# Altium schematic sheet default.SchDoc
size 420 x 297 mm; DocumentNumber: 1; SheetNumber: 1; SheetTotal: 1; PageSetup: Record=PageOptions|CenterHorizontal=False|CenterVertical=False|PrintScale=0.70|XCorrection=0.00|YCorrection=0.00|PrintKind=0|BorderSize=5000000|LeftOffset=0|BottomOffset=0|Orientation=2|PaperLength=1000|PaperWidth=1000|Scale=100|PaperSource=15|PrintQuality=-3|MediaType=1|DitherType=10|PrintScaleMode=1|PaperKind=A4|PaperIndex=9; Scale: 1:1; DocumentType: Схема электрическая принципиальная
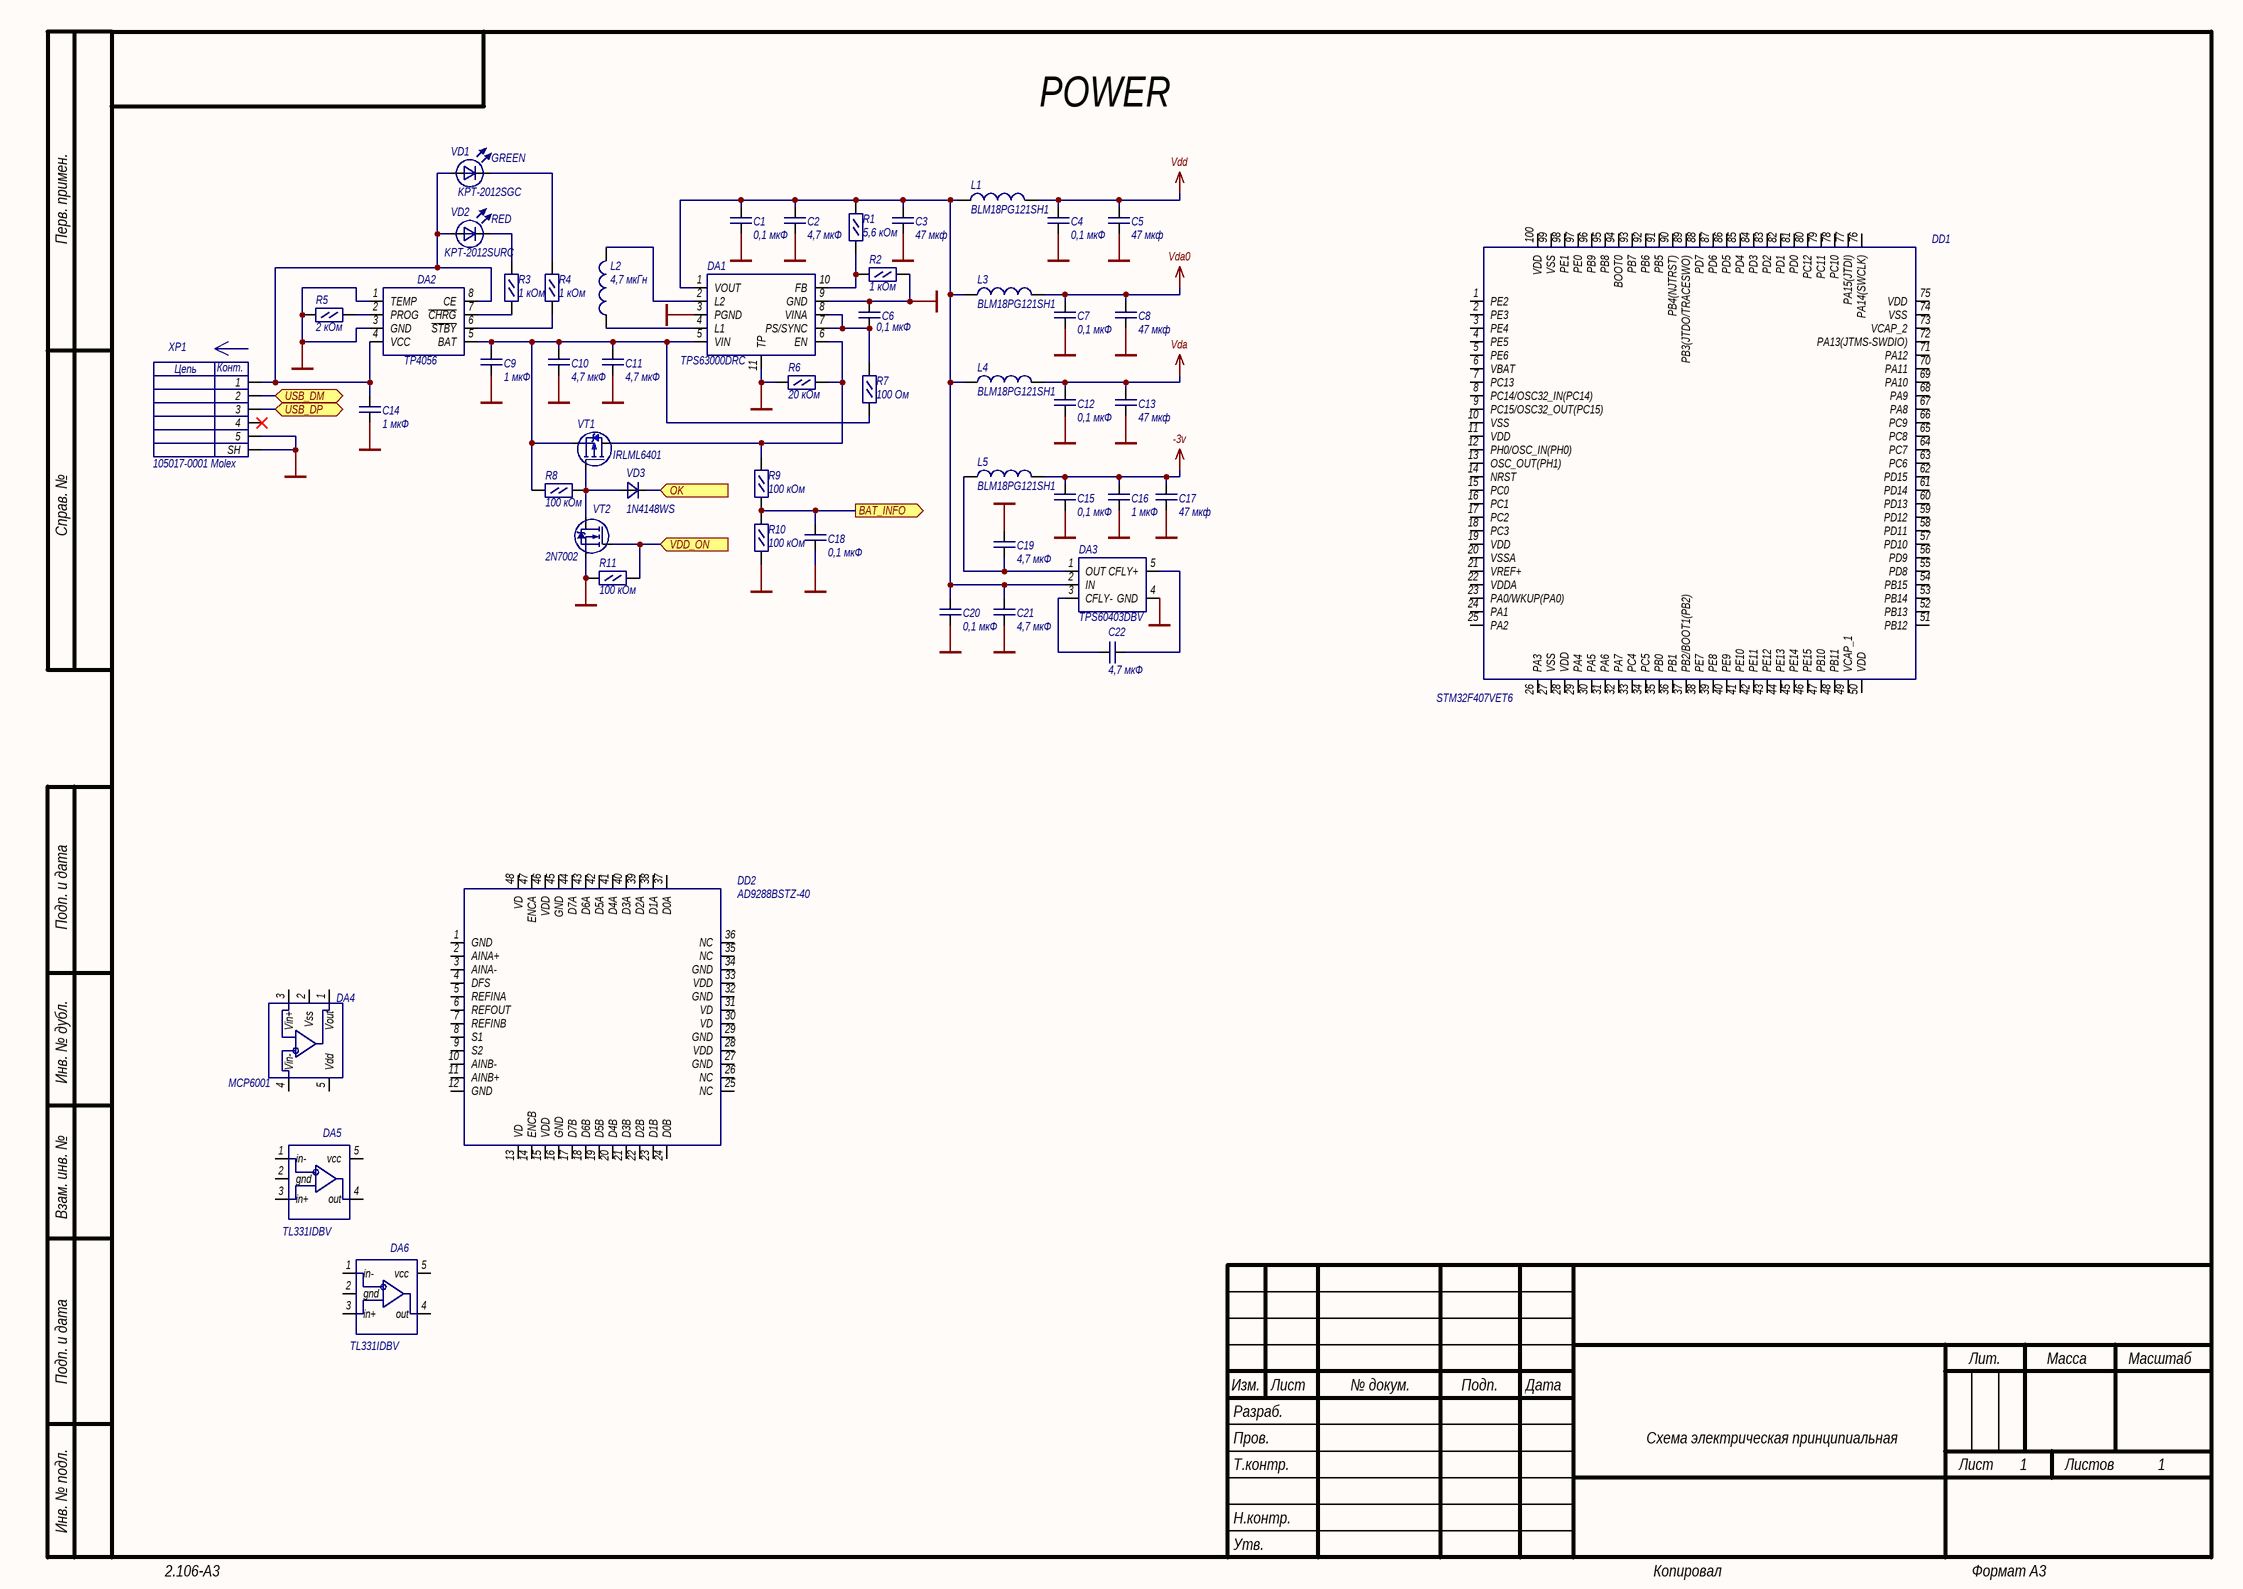
[diagram p0: default.SchDoc]

## Parts
C1  value 0,1 мкФ  [CAP0603]  (hidden comment: 0,1 мкФ 50 В)
C2  value 4,7 мкФ  [CAP0603]  (hidden comment: 4,7 мкФ 10 В)
C3  value 47 мкф  [CAP1206]  (hidden comment: 47 мкф 6,3 В)
C4  value 0,1 мкФ  [CAP0603]  (hidden comment: 0,1 мкФ 50 В)
C5  value 47 мкф  [CAP1206]  (hidden comment: 47 мкф 6,3 В)
C6  value 0,1 мкФ  [CAP0603]  (hidden comment: 0,1 мкФ 50 В)
C7  value 0,1 мкФ  [CAP0603]  (hidden comment: 0,1 мкФ 50 В)
C8  value 47 мкф  [CAP1206]  (hidden comment: 47 мкф 6,3 В)
C9  value 1 мкФ  [CAP0603]  (hidden comment: 1 мкФ 50 В)
C10  value 4,7 мкФ  [CAP0603]  (hidden comment: 4,7 мкФ 10 В)
C11  value 4,7 мкФ  [CAP0603]  (hidden comment: 4,7 мкФ 10 В)
C12  value 0,1 мкФ  [CAP0603]  (hidden comment: 0,1 мкФ 50 В)
C13  value 47 мкф  [CAP1206]  (hidden comment: 47 мкф 6,3 В)
C14  value 1 мкФ  [CAP0603]  (hidden comment: 1 мкФ 50 В)
C15  value 0,1 мкФ  [CAP0603]  (hidden comment: 0,1 мкФ 50 В)
C16  value 1 мкФ  [CAP0603]  (hidden comment: 1 мкФ 50 В)
C17  value 47 мкф  [CAP1206]  (hidden comment: 47 мкф 6,3 В)
C18  value 0,1 мкФ  [CAP0603]  (hidden comment: 0,1 мкФ 50 В)
C19  value 4,7 мкФ  [CAP0603]  (hidden comment: 4,7 мкФ 10 В)
C20  value 0,1 мкФ  [CAP0603]  (hidden comment: 0,1 мкФ 50 В)
C21  value 4,7 мкФ  [CAP0603]  (hidden comment: 4,7 мкФ 10 В)
C22  value 4,7 мкФ  [CAP0603]  (hidden comment: 4,7 мкФ 10 В)
DA1  TPS63000DRC  [SON10]
DA2  TP4056  [SO8_PAD]
DA3  TPS60403DBV  [SOT23-5]
DA4  MCP6001  [SOT23-5]
DA5  TL331IDBV  [SOT23-5]
DA6  TL331IDBV  [SOT23-5]
DD1  STM32F407VET6  [QFP100P50_1600X1600X160L60X22N]
DD2  AD9288BSTZ-40  [TQFP48_L]
L1  BLM18PG121SH1  [L0603]
L2  4,7 мкГн  [SRP4020]
L3  BLM18PG121SH1  [L0603]
L4  BLM18PG121SH1  [L0603]
L5  BLM18PG121SH1  [L0603]
R1  value 5,6 кОм  [RES0603]  (hidden comment: 5,6 кОм ±5%)
R2  value 1 кОм  [RES0603]  (hidden comment: 1 кОм ±5%)
R3  value 1 кОм  [RES0603]  (hidden comment: 1 кОм ±5%)
R4  value 1 кОм  [RES0603]  (hidden comment: 1 кОм ±5%)
R5  value 2 кОм  [RES0603]  (hidden comment: 2 кОм ±5%)
R6  value 20 кОм  [RES0603]  (hidden comment: 20 кОм ±5%)
R7  value 100 Ом  [RES0603]  (hidden comment: 100 Ом ±5%)
R8  value 100 кОм  [RES0603]  (hidden comment: 100 кОм ±5%)
R9  value 100 кОм  [RES0603]  (hidden comment: 100 кОм ±5%)
R10  value 100 кОм  [RES0603]  (hidden comment: 100 кОм ±5%)
R11  value 100 кОм  [RES0603]  (hidden comment: 100 кОм ±5%)
VD1  GREEN  value KPT-2012SGC  [LED-0805 GREEN]
VD2  RED  value KPT-2012SURC  [LED-0805 RED]
VD3  1N4148WS  [SOD323]
VT1  IRLML6401  [SOT23]
VT2  2N7002  [SOT23]
XP1  105017-0001 Molex  [USB_MICRO]

## Ports
BAT_INFO (out), OK (in), USB_DM, USB_DP, VDD_ON (in)

## Nets
-3v: C15.1 C16.1 C17.1 L5.2
GND: C1.2 C2.2 C3.2 C4.2 C5.2 C6.1 C7.2 C8.2 C9.2 C10.2 C11.2 C12.2 C13.2 C14.2 C15.2 C16.2 C17.2 C18.2 C19.2 C20.2 C21.2 DA1.3(PGND) DA1.9(GND) DA1.11(TP) DA2.1(TEMP) DA2.3(GND) DA3.4(GND) R2.1 R5.1 R6.1 R10.1 R11.1 VT2.2(S) XP1.5 XP1.SH
Vda: C12.1 C13.1 L4.2
Vda0: C7.1 C8.1 L3.2
Vdd: C4.1 C5.1 L1.2
BAT_INFO: C18.1 R9.1 R10.2 ; port BAT_INFO
OK: VD3.C ; port OK
USB_DM: XP1.2 ; port USB_DM
USB_DP: XP1.3 ; port USB_DP
VDD_ON: R11.2 VT2.1(G) ; port VDD_ON
NetC1_1: C1.1 C2.1 C3.1 C20.1 C21.1 DA1.1(VOUT) DA3.2(IN) L1.1 L3.1 L4.1 R1.2
NetC6_2: C6.2 DA1.7(PS/SYNC) DA1.8(VINA) R7.2
NetC9_1: C9.1 C10.1 C11.1 DA1.5(VIN) DA2.5(BAT) R7.1 R8.1 VT1.3(S)
NetC14_1: C14.1 DA2.4(VCC) DA2.8(CE) VD1.A VD2.A XP1.1
NetC19_1: C19.1 DA3.1(OUT) L5.1
NetC22_1: C22.1 DA3.3(CFLY-)
NetC22_2: C22.2 DA3.5(CFLY+)
NetDA1_2: DA1.2(L2) L2.2
NetDA1_4: DA1.4(L1) L2.1
NetDA1_6: DA1.6(EN) R6.2 R9.2 VT1.2(D)
NetDA1_10: DA1.10(FB) R1.1 R2.2
NetDA2_2: DA2.2(PROG) R5.2
NetDA2_6: DA2.6(~{STBY}) R4.1
NetDA2_7: DA2.7(~{CHRG}) R3.1
NetR3_2: R3.2 VD2.C
NetR4_2: R4.2 VD1.C
NetR8_2: R8.2 VD3.A VT1.1(G) VT2.3(D)

Not connected (* = marked no-connect by the designer): DA4 1(Vout) 2(Vss) 3(Vin+) 4(Vin-) 5(Vdd); DA5 1(in-) 2(gnd) 3(in+) 4(out) 5(vcc); DA6 1(in-) 2(gnd) 3(in+) 4(out) 5(vcc); DD1 1(PE2) 2(PE3) 3(PE4) 4(PE5) 5(PE6) 6(VBAT) 7(PC13) 8(PC14/OSC32_IN(PC14)) 9(PC15/OSC32_OUT(PC15)) 10(VSS) 11(VDD) 12(PH0/OSC_IN(PH0)) 13(OSC_OUT(PH1)) 14(NRST) 15(PC0) 16(PC1) 17(PC2) 18(PC3) 19(VDD) 20(VSSA) 21(VREF+) 22(VDDA) 23(PA0/WKUP(PA0)) 24(PA1) 25(PA2) 26(PA3) 27(VSS) 28(VDD) 29(PA4) 30(PA5) 31(PA6) 32(PA7) 33(PC4) 34(PC5) 35(PB0) 36(PB1) 37(PB2/BOOT1(PB2)) 38(PE7) 39(PE8) 40(PE9) 41(PE10) 42(PE11) 43(PE12) 44(PE13) 45(PE14) 46(PE15) 47(PB10) 48(PB11) 49(VCAP_1) 50(VDD) 51(PB12) 52(PB13) 53(PB14) 54(PB15) 55(PD8) 56(PD9) 57(PD10) 58(PD11) 59(PD12) 60(PD13) 61(PD14) 62(PD15) 63(PC6) 64(PC7) 65(PC8) 66(PC9) 67(PA8) 68(PA9) 69(PA10) 70(PA11) 71(PA12) 72(PA13(JTMS-SWDIO)) 73(VCAP_2) 74(VSS) 75(VDD) 76(PA14(SWCLK)) 77(PA15(JTDI)) 78(PC10) 79(PC11) 80(PC12) 81(PD0) 82(PD1) 83(PD2) 84(PD3) 85(PD4) 86(PD5) 87(PD6) 88(PD7) 89(PB3(JTDO/TRACESWO)) 90(PB4(NJTRST)) 91(PB5) 92(PB6) 93(PB7) 94(BOOT0) 95(PB8) 96(PB9) 97(PE0) 98(PE1) 99(VSS) 100(VDD); DD2 1(GND) 2(AINA+) 3(AINA-) 4(DFS) 5(REFINA) 6(REFOUT) 7(REFINB) 8(S1) 9(S2) 10(AINB-) 11(AINB+) 12(GND) 13(VD) 14(ENCB) 15(VDD) 16(GND) 17(D7B) 18(D6B) 19(D5B) 20(D4B) 21(D3B) 22(D2B) 23(D1B) 24(D0B) 25(NC) 26(NC) 27(GND) 28(VDD) 29(GND) 30(VD) 31(VD) 32(GND) 33(VDD) 34(GND) 35(NC) 36(NC) 37(D0A) 38(D1A) 39(D2A) 40(D3A) 41(D4A) 42(D5A) 43(D6A) 44(D7A) 45(GND) 46(VDD) 47(ENCA) 48(VD); XP1 4*

## Notes on the sheet
- POWER
- Перв. примен.
- Справ. №
- Подп. и дата
- Инв. № дубл.
- Взам. инв. №
- Разраб.
- Изм.
- Лист
- № докум.
- Подп.
- Дата
- Лит.
- Масса
- Масштаб
- Пров.
- Т.контр.
- Листов
- Инв. № подл.
- Утв.
- Н.контр.
- 2.106-A3
- Копировал
- Формат А3
- (in symbol CON_5_MICROUSB_105017-0001 Molex) Цепь; Конт.

## Library data of the parts
C1 C4 C6 C7 C12 C15 C18 C20 = С0603-0,1 мкФ-50 В-X7R-±10%-Yageo: Конденсатор SMD 0603; Manufacturer: Yageo; Part Number: CC0603KRX7R9BB104; Tolerance: ±10%; Voltage: 50 В; Type: X7R; Identifier: С0603-0,1 мкФ-50 В-X7R-±10%-Yageo; Value BOM: 0,1 мкФ; Operating Temperature: -55°C to +105°C; HelpURL: D:\_DS\CAP_YAGEO UPY-GPHC_X7R_6.3V-to-50V_16.pdf
C2 C10 C11 C19 C21 C22 = С0603-4,7 мкФ-10 В-X5R-±10%-Yageo: Конденсатор SMD 0603; Manufacturer: Yageo; Part Number: CC0603KRX5R6BB475; Tolerance: ±10%; Voltage: 10 В; Type: X5R; Identifier: С0603-4,7 мкФ-10 В-X5R-±10%-Yageo; Value BOM: 4,7 мкФ; Operating Temperature: -55°C to +85°C; HelpURL: D:\_DS\CAP_YAGEO UPY-GPHC_X5R_4V-to-50V_23.pdf
C3 C5 C8 C13 C17 = С1206-47 мкф-6,3 В-X5R-±20%-Murata: Конденсатор керамический; Manufacturer: Murata; Part Number: GRM31CR60J476ME19L; Tolerance: ±20%; Voltage: 6,3 В; Type: X5R; Identifier: С1206-47 мкф-6,3 В-X5R-±20%-Murata; Value BOM: 47 мкф; Case: 1206; Operating Temperature: -55°C to +85°C; HelpURL: D:\_DS\MURATA_chip-monolithic-ceramic-capacitors.pdf
C9 C14 C16 = С0603-1 мкФ-50 В-X7R-±10%-Yageo: Конденсатор SMD 0603; Manufacturer: Yageo; Part Number: CC0603KRX7R9BB105; Tolerance: ±10%; Voltage: 50 В; Type: X7R; Identifier: С0603-1 мкФ-50 В-X7R-±10%-Yageo; Value BOM: 1 мкФ; Operating Temperature: -55°C to +105°C; HelpURL: D:\_DS\CAP_YAGEO UPY-GPHC_X7R_6.3V-to-50V_16.pdf
DA1 = TPS63000DRC SON10  Texas: Микросхема; Manufacturer: Texas Instruments; Value: TPS63000DRC; Identifier: TPS63000DRC SON10  Texas; Case: SON10; Part Number: TPS63000DRC; Operating Temperature: -40°C to 85°C; HelpURL: D:\_DS\TPS63000.pdf
DA2 = TP4056 SO8 NanJing: Микросхема; Manufacturer: NanJing Top Power; Part Number: TP4056-42-SOP8-PP; Value: TP4056; Identifier: TP4056 SO8 NanJing; Case: SO8; Operating Temperature: -40°C to 85°C; HelpURL: D:\_DS\TP4056.pdf
DA3 = TPS60403DBV SOT23-5 Texas: Микросхема; Manufacturer: Texas Instruments; Value: TPS60403DBV; Identifier: TPS60403DBV SOT23-5 Texas; Case: SOT23-5; Part Number: TPS60403DBV; Operating Temperature: -40°C to 125°C; HelpURL: D:\_DS\TPS60403.pdf
DA4 = MCP6001RT-E/OT SOT23-5 Microchip: Микросхема; Value: MCP6001; Identifier: MCP6001RT-E/OT SOT23-5 Microchip; Case: SOT23-5; Manufacturer: Microchip; Part Number: MCP6001RT-E/OT; Operating Temperature: -40°C to 125°C; HelpURL: D:\_DS\MCP6001.pdf
DA5 DA6 = TL331IDBV SOT23-5 Texas Instruments: Микросхема; Value: TL331IDBV; Identifier: TL331IDBV SOT23-5 Texas Instruments; Case: SOT23-5; Manufacturer: Texas Instruments; Part Number: TL331IDBV; Operating Temperature: -40°C to 150°C; HelpURL: D:\_DS\TL331IDBV.pdf
DD1 = STM32F407VET6 TQFP100 STM: Микросхема; Manufacturer: STMicroelectronics; Value: STM32F407VET6; Identifier: STM32F407VET6 TQFP100 STM; Case: TQFP100; Part Number: STM32F407VET6; Operating Temperature: -40°C to 105°C; HelpURL: D:\_DS\STM32F407V.pdf
DD2 = AD9288BSTZ-40 LQFP48 Analog Devices: Микросхема; Value: AD9288BSTZ-40; Identifier: AD9288BSTZ-40 LQFP48 Analog Devices; Case: LQFP48; Manufacturer: Analog Devices; Part Number: AD9288BSTZ-40; Operating Temperature: -55°C to 125°C; HelpURL: D:\_DS\AD9288BSTZ.pdf
L1 L3-L5 = BLM18PG121SH1-Murata: Фильтр ЭМП; Manufacturer: Murata; Value: BLM18PG121SH1; Identifier: BLM18PG121SH1-Murata; Case: 0603; Part Number: BLM18PG121SH1; Operating Temperature: -55 to 125 °C
L2 = SRP4020TA-4R7M Bourns: Дроссель; Manufacturer: Bourns; Value: 4,7 мкГн; Identifier: SRP4020TA-4R7M Bourns; Value BOM: 4,7 мкГн; Case: SMD; Part Number: SRP4020TA-4R7M; Operating Temperature: -40°C to 150°C; HelpURL: D:\_DS\SRP4020TA-4R7M.pdf
R1 = RC0603-5,6 кОм-5%-Yageo: Резистор SMD 0603; Manufacturer: YAGEO; Part Number: RC0603JR-075K6L; Identifier: RC0603-5,6 кОм-5%-Yageo; Value BOM: 5,6 кОм; Tolerance: ±5%; Operating Temperature: -55°C to +155°C; Price: 0.00
R2-R4 = RC0603-1 кОм-5%-Yageo: Резистор SMD 0603; Manufacturer: YAGEO; Part Number: RC0603JR-071KL; Identifier: RC0603-1 кОм-5%-Yageo; Value BOM: 1 кОм; Tolerance: ±5%; Operating Temperature: -55°C to +155°C; Price: 0.00
R5 = RC0603-2 кОм-5%-Yageo: Резистор SMD 0603; Manufacturer: YAGEO; Part Number: RC0603JR-072KL; Identifier: RC0603-2 кОм-5%-Yageo; Value BOM: 2 кОм; Tolerance: ±5%; Operating Temperature: -55°C to +155°C; Price: 0.00
R6 = RC0603-20 кОм-5%-Yageo: Резистор SMD 0603; Manufacturer: YAGEO; Part Number: RC0603JR-0720KL; Identifier: RC0603-20 кОм-5%-Yageo; Value BOM: 20 кОм; Tolerance: ±5%; Operating Temperature: -55°C to +155°C; Price: 0.00
R7 = RC0603-100 Ом-5%-Yageo: Резистор SMD 0603; Manufacturer: YAGEO; Part Number: RC0603JR-07100RL; Identifier: RC0603-100 Ом-5%-Yageo; Value BOM: 100 Ом; Tolerance: ±5%; Operating Temperature: -55°C to +155°C; Price: 0.00
R8-R11 = RC0603-100 кОм-5%-Yageo: Резистор SMD 0603; Manufacturer: YAGEO; Part Number: RC0603JR-07100KL; Identifier: RC0603-100 кОм-5%-Yageo; Value BOM: 100 кОм; Tolerance: ±5%; Operating Temperature: -55°C to +155°C; Price: 0.00
VD1 = KPT-2012SGC GREEN: Светодиод; Manufacturer: Kingbright; Type: Зеленый; Identifier: KPT-2012SGC GREEN; Case: 0805; Part Number: KPT-2012SGC; Operating Temperature: -40 to 85 °C
VD2 = KPT-2012SURC RED: Светодиод; Manufacturer: Kingbright; Type: Красный; Identifier: KPT-2012SURC RED; Case: 0805; Part Number: KPT-2012SURC; Operating Temperature: -40 to 85 °C
VD3 = 1N4148WS SOD-323 Diodes: Диод; Manufacturer: Diodes; Value: 1N4148WS; Identifier: 1N4148WS SOD-323 Diodes; Case: SOD-323; Part Number: 1N4148WS; Operating Temperature: -65°C to 150°C; Price: 0; HelpURL: D:\_DS\1N4148WS.pdf
VT1 = IRLML6401 SOT23 Infineon: Транзистор; Voltage: 12V 3,4A 50mOhm; Value: IRLML6401; Identifier: IRLML6401 SOT23 Infineon; Case: SOT23; Manufacturer: Infineon; Part Number: IRLML6401; Type: P-MOSFET; Operating Temperature: -55 to +150 C; HelpURL: D:\_DS\IRLML6401.pdf
VT2 = 2N7002 SOT23: Транзистор; Manufacturer: NXP; Type: N-MOSFET; Value: 2N7002; Identifier: 2N7002 SOT23; Case: SOT23; Part Number: 2N7002; Operating Temperature: -55 to +150 C; Price: 25,4
XP1 = CON_5_MICROUSB_105017-0001 Molex: Разъем; Value: 105017-0001 Molex; Identifier: CON_5_MICROUSB_105017-0001 Molex; Manufacturer: Molex; Part Number: 105017-0001; Operating Temperature: -30 to 85 °C; HelpURL: D:\_DS\_Molex\1050170001_sd.pdf